# Altium project My_own_adruino.PrjPcb
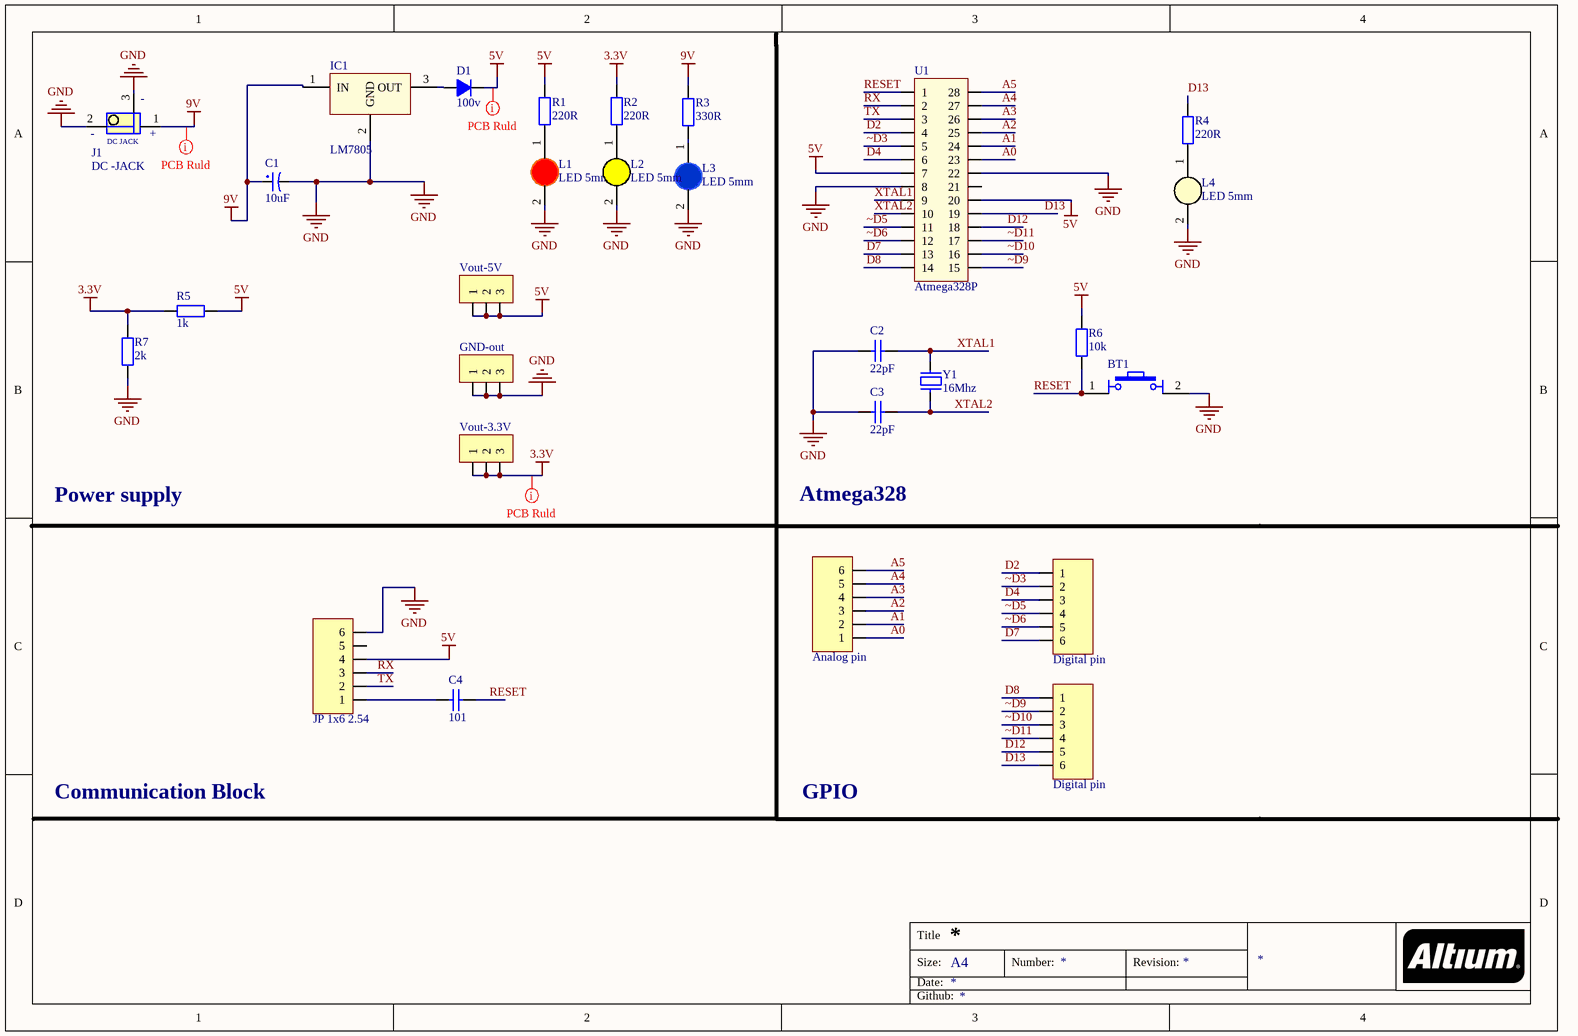
[diagram p0: Schematic.SchDoc]
1 sheet, 28 parts. Net scope: global (net labels, ports and power ports of the same name join across sheets).
Board file: PCB.PcbDoc

## Sheet Schematic.SchDoc
size A4; Organization: Altium Limited; Address1: L3, 12a Rodborough Rd; Address2: Frenchs Forest; Address3: NSW; Address4: Australia 2086; SheetNumber: 1; SheetTotal: 1

### Parts
BT1  Nut Nhan 4 Chan Cam 6x6  [Nut Nhan 4 Chan Cam 6x6]  (value not drawn)
C1  10uF  [tu hoa 4mm]
C2  22pF  [tu gom]
C3  22pF  [tu gom]
C4  101  [tu gom]
D1  100v  [DIODE 1A]
GND-out  JP 1x3 2.54  [JP 1x3 DT]  (value not drawn)
IC1  LM7805  [QTO-220]
J1  DC -JACK  [CON3_129_PJ-002A_TH_RA]
JP1  Digital pin  [JP 1x6 CT]
JP2  Analog pin  [JP 1x6 CT]
JP3  JP 1x6 2.54  [JP 1x6 CC]
JP4  Digital pin  [JP 1x6 CT]
L1  LED 5mm  [LED-5MM-RED]
L2  LED 5mm  [LED-5MM-Yellow]
L3  LED 5mm  [LED-5MM-BLUE]
L4  LED 5mm  [LED-5MM-WHITE]
R1  220R  [tro vach 1/2w]
R2  220R  [tro vach 1/2w]
R3  330R  [tro vach 1/2w]
R4  220R  [tro vach 1/2w]
R5  1k  [tro vach 1/2w]
R6  10k  [tro vach 1/2w]
R7  2k  [tro vach 1/4w]
U1  Atmega328P  [DIP28/W0.3]
Vout-3.3V  JP 1x3 2.54  [JP 1x3 DT]  (value not drawn)
Vout-5V  JP 1x3 2.54  [JP 1x3 DT]  (value not drawn)
Y1  16Mhz  [Thach Anh 2 chan cam]

### Nets
3.3V: R2.2 R5.1 R7.2 Vout-3.3V.1 Vout-3.3V.2 Vout-3.3V.3
5V: D1.2(K) JP3.4 R1.2 R5.2 R6.2 U1.7 U1.20 Vout-5V.1 Vout-5V.2 Vout-5V.3
9V: C1.1 IC1.1(IN) J1.1 R3.2
GND: BT1.2 C1.2 C2.2 C3.2 GND-out.1 GND-out.2 GND-out.3 IC1.2(GND) J1.2 J1.3(-) JP3.6 L1.2(K) L2.2(K) L3.2(K) L4.2(K) R7.1 U1.8 U1.22
A0: JP2.1 U1.23
A1: JP2.2 U1.24
A2: JP2.3 U1.25
A3: JP2.4 U1.26
A4: JP2.5 U1.27
A5: JP2.6 U1.28
D2: JP1.1 U1.4
D4: JP1.3 U1.6
D7: JP1.6 U1.13
D8: JP4.1 U1.14
D12: JP4.5 U1.18
D13: JP4.6 R4.2 U1.19
RESET: BT1.1 C4.1 R6.1 U1.1
RX: JP3.3 U1.2
TX: JP3.2 U1.3
XTAL1: C2.1 U1.9 Y1.2
XTAL2: C3.1 U1.10 Y1.1
~D3: JP1.2 U1.5
~D5: JP1.4 U1.11
~D6: JP1.5 U1.12
~D9: JP4.2 U1.15
~D10: JP4.3 U1.16
~D11: JP4.4 U1.17
NetC4_2: C4.2 JP3.1
NetD1_1: D1.1(A) IC1.3(OUT)
NetL1_1: L1.1(A) R1.1
NetL2_1: L2.1(A) R2.1
NetL3_1: L3.1(A) R3.1
NetL4_1: L4.1(A) R4.1

Not connected (* = marked no-connect by the designer): JP3 5; U1 21

### Layout directives
rule Width Constraint [Pref Width = 30mil    Min Width = 30mil    Max Width = 30mil]: 9V
rule Width Constraint [Pref Width = 25mil    Min Width = 25mil    Max Width = 25mil]: 3.3V, 5V

### Notes on the sheet
- Power supply
- Atmega328
- Communication Block
- GPIO
- Title
- Size:
- Date:
- A4
- Number:
- Revision:
- Github:
- (in symbol CON-PLG_3X1-228-DC_JACK) +; DC JACK

### Library data of the parts
BT1 = Nut Nhan 4 Chan Cam 6x6: Nut Nhan 4 Chan 6x6mm; Ten: Nút Nhấn 4 Chân 6x6x5MM DIP; Ma_Hang: MH004584
C1 = Tu Hoa 10uF 25V 4x7: Cắm; So_Chan: 2; Ten_Linh_Kien: Tụ Hóa 10uF 25V 4x7MM; Don_Vi: Con; Ma_Hang: MH001349; Chung_Loai: Cắm; Kieu_Chan: *
C2 C3 = Tu gom 22pF 50V: Cắm; Don_Vi: Con; So_Chan: 2; Ten_Linh_Kien: Tụ gốm 22P 50V; Ma_Hang: MH004771; Chung_Loai: Cắm; Kieu_Chan: *
C4 = Tu gom 101 50V: Cắm; Don_Vi: Con; So_Chan: 2; Ten_Linh_Kien: Tụ gốm 101 0.1nF 50V; Ma_Hang: MH004764; Chung_Loai: Cắm; Kieu_Chan: *
D1 = Diode 1N4007: Cắm; Ten_Linh_Kien: Diode 1N4007 1A (DIP); Don_Vi: Con; Ma_Hang: MH001063; Ghi Chu: *; Kieu_Chan: *; Chung_Loai: Cắm
GND-out Vout-3.3V Vout-5V = JP 1x3 2.54 Duc Thang: Cắm; Ten_Linh_Kien: Jump Đơn Đực 2.54MM 1x40P Thẳng 11MM; Don_Vi: Con; Ma_Hang: MH000903; Ghi_Chu: *; Kieu_Chan: *; Chung_Loai: Cắm
IC1 = LM78xx: On ap +, from + 5 to + 24VDC; Value: LM7805
J1 = CON-PLG_3X1-228-DC_JACK: 3 Pins, 1 Row 228mil Pitch, right angle Connector, male; Manufacturer: JST; Manufacturer Part Number: PJ-002A; Alternate Part Number-1: NA; Case/Package: TH-CON; Supplier-1: SP ROAD; Supplier Part Number-1: NA
JP1 JP2 JP4 = JP 1x6 2.54 Cai Thang: Cắm; Ten_Linh_Kien: Jump Đơn Cái 2.54MM 1x20P Thẳng; Don_Vi: Con; Ma_Hang: MH004006; Ghi_Chu: *; Kieu_Chan: *; Chung_Loai: Cắm
JP3 = JP 1x6 2.54 Cai Cong: Cắm; Ten_Linh_Kien: Jump Đơn Cái 2.54MM 1x40P Cong; Don_Vi: Con; Ma_Hang: MH001265; Ghi_Chu: *; Kieu_Chan: *; Chung_Loai: Cắm
L1 = LED 5mm Do: Cắm; Don_Vi: Con; Ma_Hang: MH008967; Ten_Linh_Kien: Led 5MM Phủ Đỏ (1000c); Ghi_Chu: *; Kieu_Chan: *; Chung_Loai: Cắm
L2 = LED 5mm Vang: Cắm; Don_Vi: Con; Ma_Hang: MH008968; Ten_Linh_Kien: Led 5MM Phủ Vàng (1000c); Ghi_Chu: *; Kieu_Chan: *; Chung_Loai: Cắm
L3 = LED 5mm Xanh Duong: Cắm; Don_Vi: Con; Ma_Hang: MH008987; Ten_Linh_Kien: Led 5MM Xanh Dương Đục (1000c); Ghi_Chu: *; Kieu_Chan: *; Chung_Loai: Cắm
L4 = LED 5mm Trang: Cắm; Don_Vi: Con; Ma_Hang: MH008983; Ten_Linh_Kien: Led 5MM Trắng Đục (1000c); Ghi_Chu: *; Kieu_Chan: *; Chung_Loai: Cắm
R1 R2 R4 = Tro Vach 1/2W 5% 240R: Cắm; Don_Vi: Con; So_Chan: 2; Ten_Linh_Kien: Trở 5% 1/2w 240R; Ma_Hang: MH006191; Kieu_Chan: *; Chung_Loai: Cắm
R3 = Tro Vach 1/2W 5% 330R: Cắm; Don_Vi: Con; So_Chan: 2; Ten_Linh_Kien: Trở 5% 1/2w 330R; Ma_Hang: MH006204; Chung_Loai: Cắm; Kieu_Chan: *
R5 = Tro Vach 1/2W 5% 1k: Cắm; Don_Vi: Con; So_Chan: 2; Ten_Linh_Kien: Trở 5% 1/2w 1K; Ma_Hang: MH007240; Chung_Loai: Cắm; Kieu_Chan: *
R6 = Tro Vach 1/2W 5% 10k: Cắm; Don_Vi: Con; So_Chan: 2; Ten_Linh_Kien: Trở 5% 1/2w 10k; Ma_Hang: MH006206; Chung_Loai: Cắm; Kieu_Chan: *
R7 = Tro Vach 1/4W 5% 2k: Cắm; Don_Vi: Con; So_Chan: 2; Ten_Linh_Kien: Trở Vạch 1/4w 5% 2k; Ma_Hang: MH007305; Chung_Loai: Cắm; Kieu_Chan: *
U1 = DIP28: Value: DIP28
Y1 = Thach Anh 2 chan Cam: Crystal For all Crystal 2pin.; Value: 4Mhz